# EAGLE design lis100 (EAGLE 9.6.2)
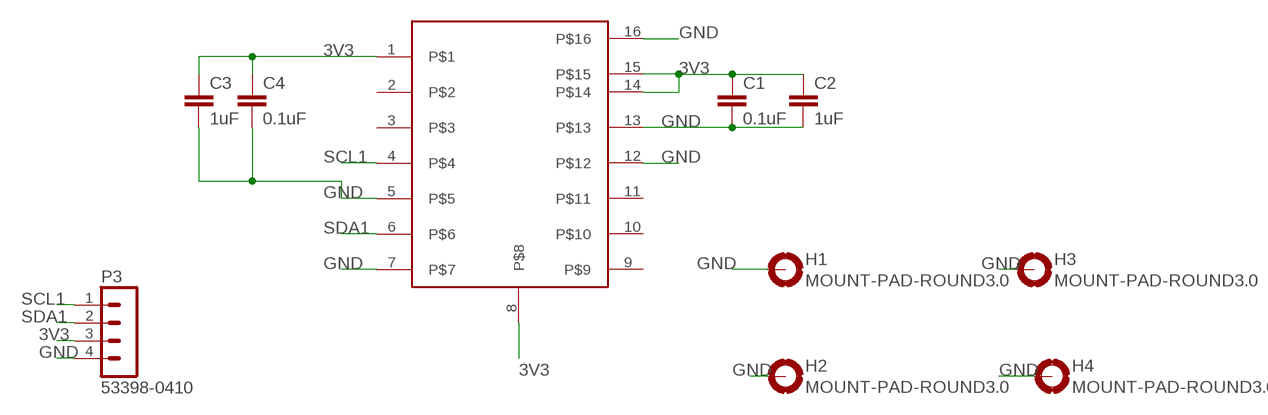
[diagram p0: schematic, sheet 1]

## Parts
C1  0.1uF  C-EUC0603  [C0603]
C2  1uF  C-EUC0603  [C0603]
C3  1uF  C-EUC0603  [C0603]
C4  0.1uF  C-EUC0603  [C0603]
H1  MOUNT-PAD-ROUND3.0  [3,0-PAD]
H2  MOUNT-PAD-ROUND3.0  [3,0-PAD]
H3  MOUNT-PAD-ROUND3.0  [3,0-PAD]
H4  MOUNT-PAD-ROUND3.0  [3,0-PAD]
P3  53398-0410  [53398-0410]
U$1  H3LIS100DL  [XDCR_LIS3DHTR]

## Nets
3V3: C1.1 C2.1 C3.1 C4.1 P3.3 U$1.1 U$1.8 U$1.14 U$1.15
GND: C1.2 C2.2 C3.2 C4.2 H1.B3,0(MOUNT) H2.B3,0(MOUNT) H3.B3,0(MOUNT) H4.B3,0(MOUNT) P3.4 U$1.5 U$1.7 U$1.12 U$1.13 U$1.16
SCL1: P3.1 U$1.4
SDA1: P3.2 U$1.6
Unconnected: U$1.2 U$1.3 U$1.9 U$1.10 U$1.11

## Library data of the parts
C1-C4 = rcl:C-EU: CAPACITOR, European symbol; SPICEPREFIX: C
H1-H4 = holes:MOUNT-PAD-ROUND: MOUNTING PAD, round
P3 = con-molex-picoblade:53398-0410: HEADER
U$1 = LIS3DHTR:H3LIS100DL

## Board
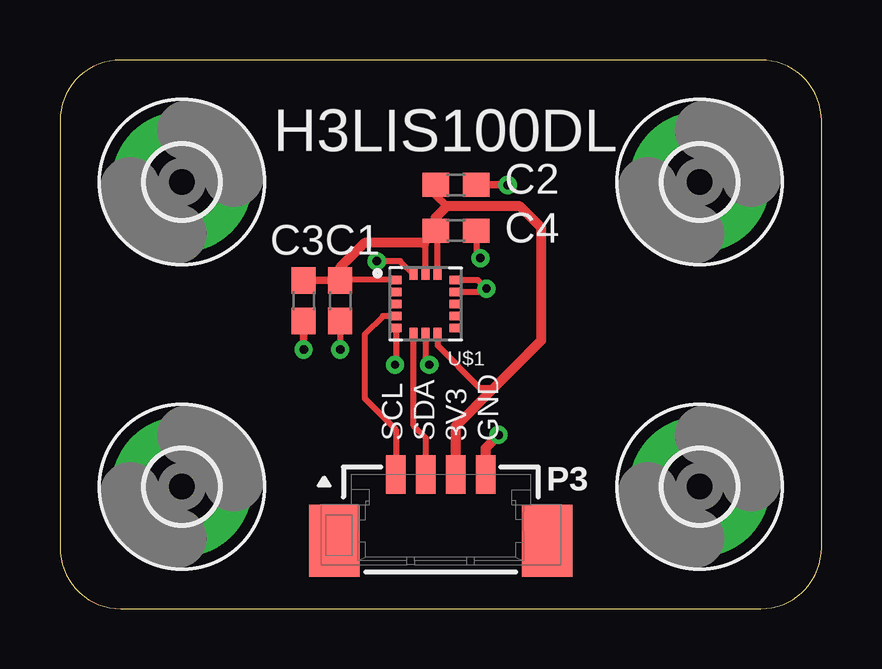
[diagram p1: board, top side]
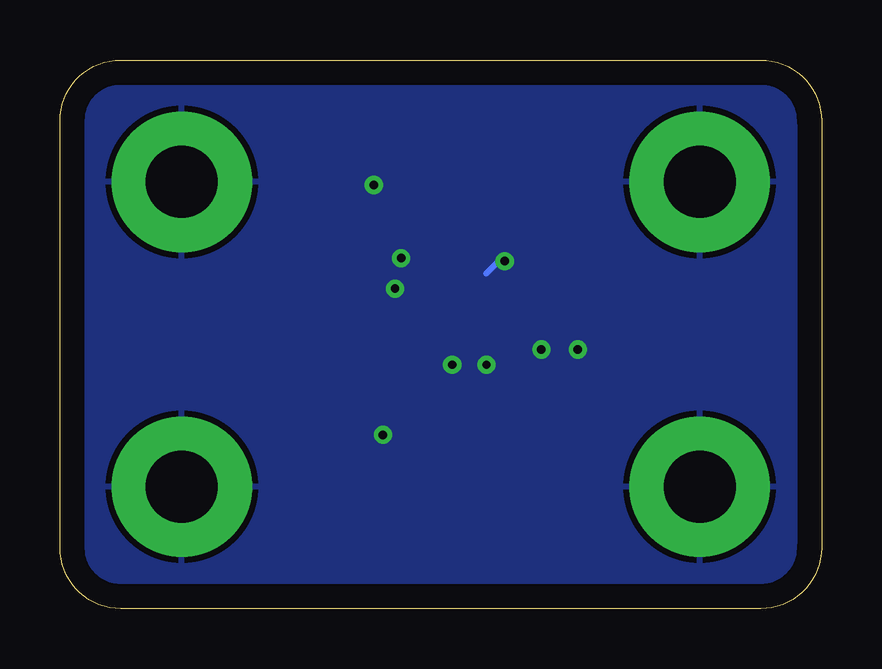
[diagram p2: board, bottom side, seen from below]

Size 31.75 x 22.86 mm. Coordinates in mm from the lower left corner, seen from the top.
Outline: 0,20.32 0,2.54 arc90 2.54,0 29.21,0 arc90 31.75,2.54 31.75,20.32 arc90 29.21,22.86 2.54,22.86 arc90 0,20.32
Copper layers (1*16): Top 0.035mm / dielectric 1.5mm / Bottom 0.035mm
Design rules "default *": minimum track width 6mil, minimum drill 0.35mm, track to track 6mil, track to pad 6mil, pad to pad 6mil, via to via 6mil, smd to smd 6mil, copper to edge 40mil, drill to drill 6mil, minimum pad ring 10mil, minimum via ring 8mil, stop-mask expansion 4mil, vias tented up to drill 14mil, thermal gap 10mil

### Footprints (pad centres in the part's own frame; a part is rotated, then mirrored left to right if it is on the bottom)
C0603 = smd 1.1 x 1: 1 -0.85,0; 2 0.85,0
3,0-PAD = drill 3 pad 5.842: B3,0 0,0
53398-0410 = smd 0.8 x 1.6: 1 1.875,0; 2 0.625,0; 3 -0.625,0; 4 -1.875,0 | smd 2.1 x 3: M1 4.435,2.75; M2 -4.435,2.75
XDCR_LIS3DHTR = smd 0.45 x 0.35: 1 -1.225,1; 2 -1.225,0.5; 3 -1.225,0; 4 -1.225,-0.5; 5 -1.225,-1; 9 1.225,-1; 10 1.225,-0.5; 11 1.225,0; 12 1.225,0.5; 13 1.225,1 | smd 0.35 x 0.45: 6 -0.5,-1.225; 7 0,-1.225; 8 0.5,-1.225; 14 0.5,1.225; 15 0,1.225; 16 -0.5,1.225

### Placement (x,y rotation side)
C1  11.68,12.83 270 top
C2  16.51,17.65 0 top
C3  10.16,12.83 270 top
C4  16.51,15.75 0 top
H1  5.08,17.78 0 top
H2  5.08,5.08 0 top
H3  26.67,5.08 0 top
H4  26.67,17.78 0 top
P3  15.88,5.59 180 top
U$1  15.24,12.7 0 top

### Tracks (layer width: path | path; a pad name or v marks a point on that pad's centre or on a via)
3V3
  Top 0.254: U$1.14 15.74,15.67 C4.1 | U$1.1 11.71,13.7 C1.1 | U$1.15 15.24,15.15 15.15,15.24 | U$1.8 15.74,10.97 17.5,9.21 18.1,9.21
  Top 0.305: C1.1 C3.1 | C2.1 15.66,17.23 16.13,16.76
  Top 0.406: P3.3 16.5,7.61 18.1,9.21 20.07,11.18 20.07,15.88 19.18,16.76 16.13,16.76 15.66,16.3 C4.1 15.15,15.24 12.7,15.24 11.68,14.22 C1.1
GND  (via drill 0.35)
  Top 0.254: U$1.5 14.02,10.21 v13.97,10.16 | U$1.7 15.24,10.32 v15.4,10.16 | U$1.13 17.41,13.7 v17.78,13.34 17.64,13.2 U$1.12 | U$1.16 14.19,14.48 v13.21,14.48 | C1.2 v11.68,10.79 | C4.2 17.36,14.77 v17.53,14.61
  Top 0.305: C2.2 v18.67,17.65 | C3.2 v10.16,10.79
  Top 0.406: P3.4 17.75,6.7 v18.29,7.24
  Bottom 0.254: v13.21,14.48 13.46,14.48 13.97,13.97
  pour Bottom: 0,24.13 33.02,24.13 33.02,-1.27 -1.27,-1.27 -1.27,24.13
SCL1
  Top 0.254: U$1.4 14.01,12.19 13.46,12.19 12.7,11.43 12.7,8.76 14,7.46 P3.1
SDA1
  Top 0.254: P3.2 15.25,7.11 14.74,7.62 U$1.6

### Text on the board
tNames: H3LIS100DL | SCL / SDA / 3V3 / GND